# EAGLE schematic Wireless Power Transmission Project (EAGLE 6.5.0)
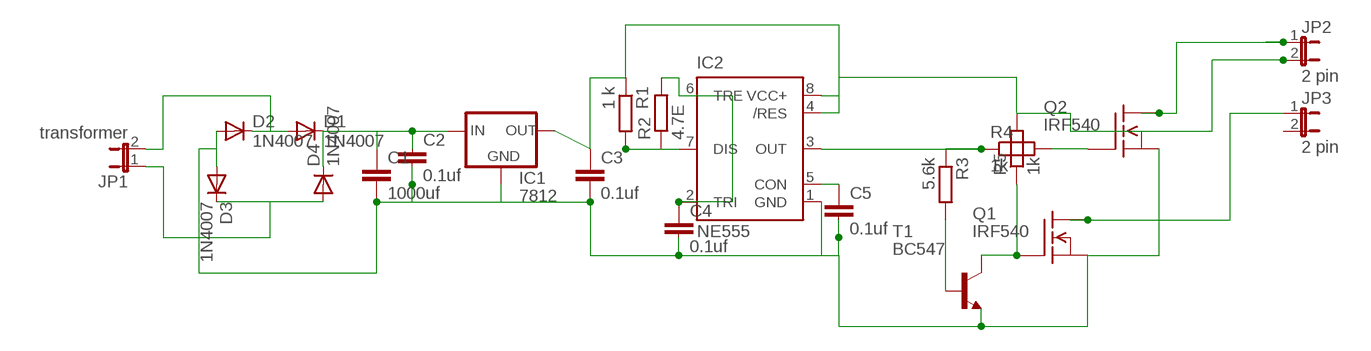
[diagram p0: schematic, sheet 1]

## Parts
C1  1000uf  C2.5/5  [C2.5-5]
C2  0.1uf  C2.5/5  [C2.5-5]
C3  0.1uf  C2.5/5  [C2.5-5]
C4  0.1uf  C2.5/5  [C2.5-5]
C5  0.1uf  C2,5-3  [C2.5-3]
D1  1N4007  1N4004  [DO41-10]
D2  1N4007  1N4004  [DO41-10]
D3  1N4007  1N4004  [DO41-10]
D4  1N4007  1N4004  [DO41-10]
IC1  7812  78XXL  [78XXL]
IC2  NE555  [DIL-08]
JP1  transformer  JP1E  [JP1]
JP2  2 pin  JP1E  [JP1]
JP3  2 pin  JP1E  [JP1]
Q1  IRF540  [TO220]
Q2  IRF540  [TO220]
R1  1 k  R-EU_0204/7  [0204/7]
R2  4.7E  R-EU_0204/7  [0204/7]
R3  5.6k  R-EU_0204/7  [0204/7]
R4  1k  R-EU_0204/7  [0204/7]
R5  1k  R-EU_0204/7  [0204/7]
T1  BC547  [TO92]

## Nets
N$1: D1.A D2.C JP1.2
N$2: C1.2 C2.2 C3.2 C4.2 C5.2 D2.A D3.A IC1.GND IC2.1(GND) Q1.3(S) Q2.3(S) T1.1(E)
N$3: D3.C D4.A JP1.1
N$4: C1.1 C2.1 D1.C D4.C IC1.IN
N$5: C5.1 IC2.5(CON)
N$6: IC2.3(OUT) R3.1 R4.1
N$7: C3.1 IC1.OUT IC2.4(/RES) IC2.8(VCC+) JP2.2 R1.1 R5.2
N$9: IC2.7(DIS) R1.2 R2.1
N$10: R3.2 T1.2(B)
N$11: C4.1 IC2.2(TRI) IC2.6(TRE) R2.2
N$12: Q1.1(G) R5.1 T1.3(C)
N$13: Q2.1(G) R4.2
N$14: JP2.1 Q2.2(D)
N$15: JP3.1 Q1.2(D)
Unconnected: JP3.2

## Library data of the parts
C1-C5 = capacitor-wima:C: CAPACITOR naming: grid - package width
D1-D4 = diode:1N4004: DIODE general purpose rectifier, 1 A
IC1 = v-reg:78XXL: VOLTAGE REGULATOR
IC2 = st-microelectronics:NE555: General purpose bipolar Timer; MF: Arrow Electronics; MPN: NE555N; OC_FARNELL: 1467742; OC_NEWARK: 89K1486
JP1-JP3 = jumper:JP1E: JUMPER
Q1 Q2 = transistor-fet:IRF540: N-Channel Enhancement MOSFET (HEXFET); 100V; 28A; 0,077Ohm
R1-R5 = rcl:R-EU_: RESISTOR, European symbol
T1 = transistor:BC547: NPN TRANSISTOR